# EAGLE schematic analog_heteroThermistor_3xChannel_R3 (EAGLE 7.6.0)
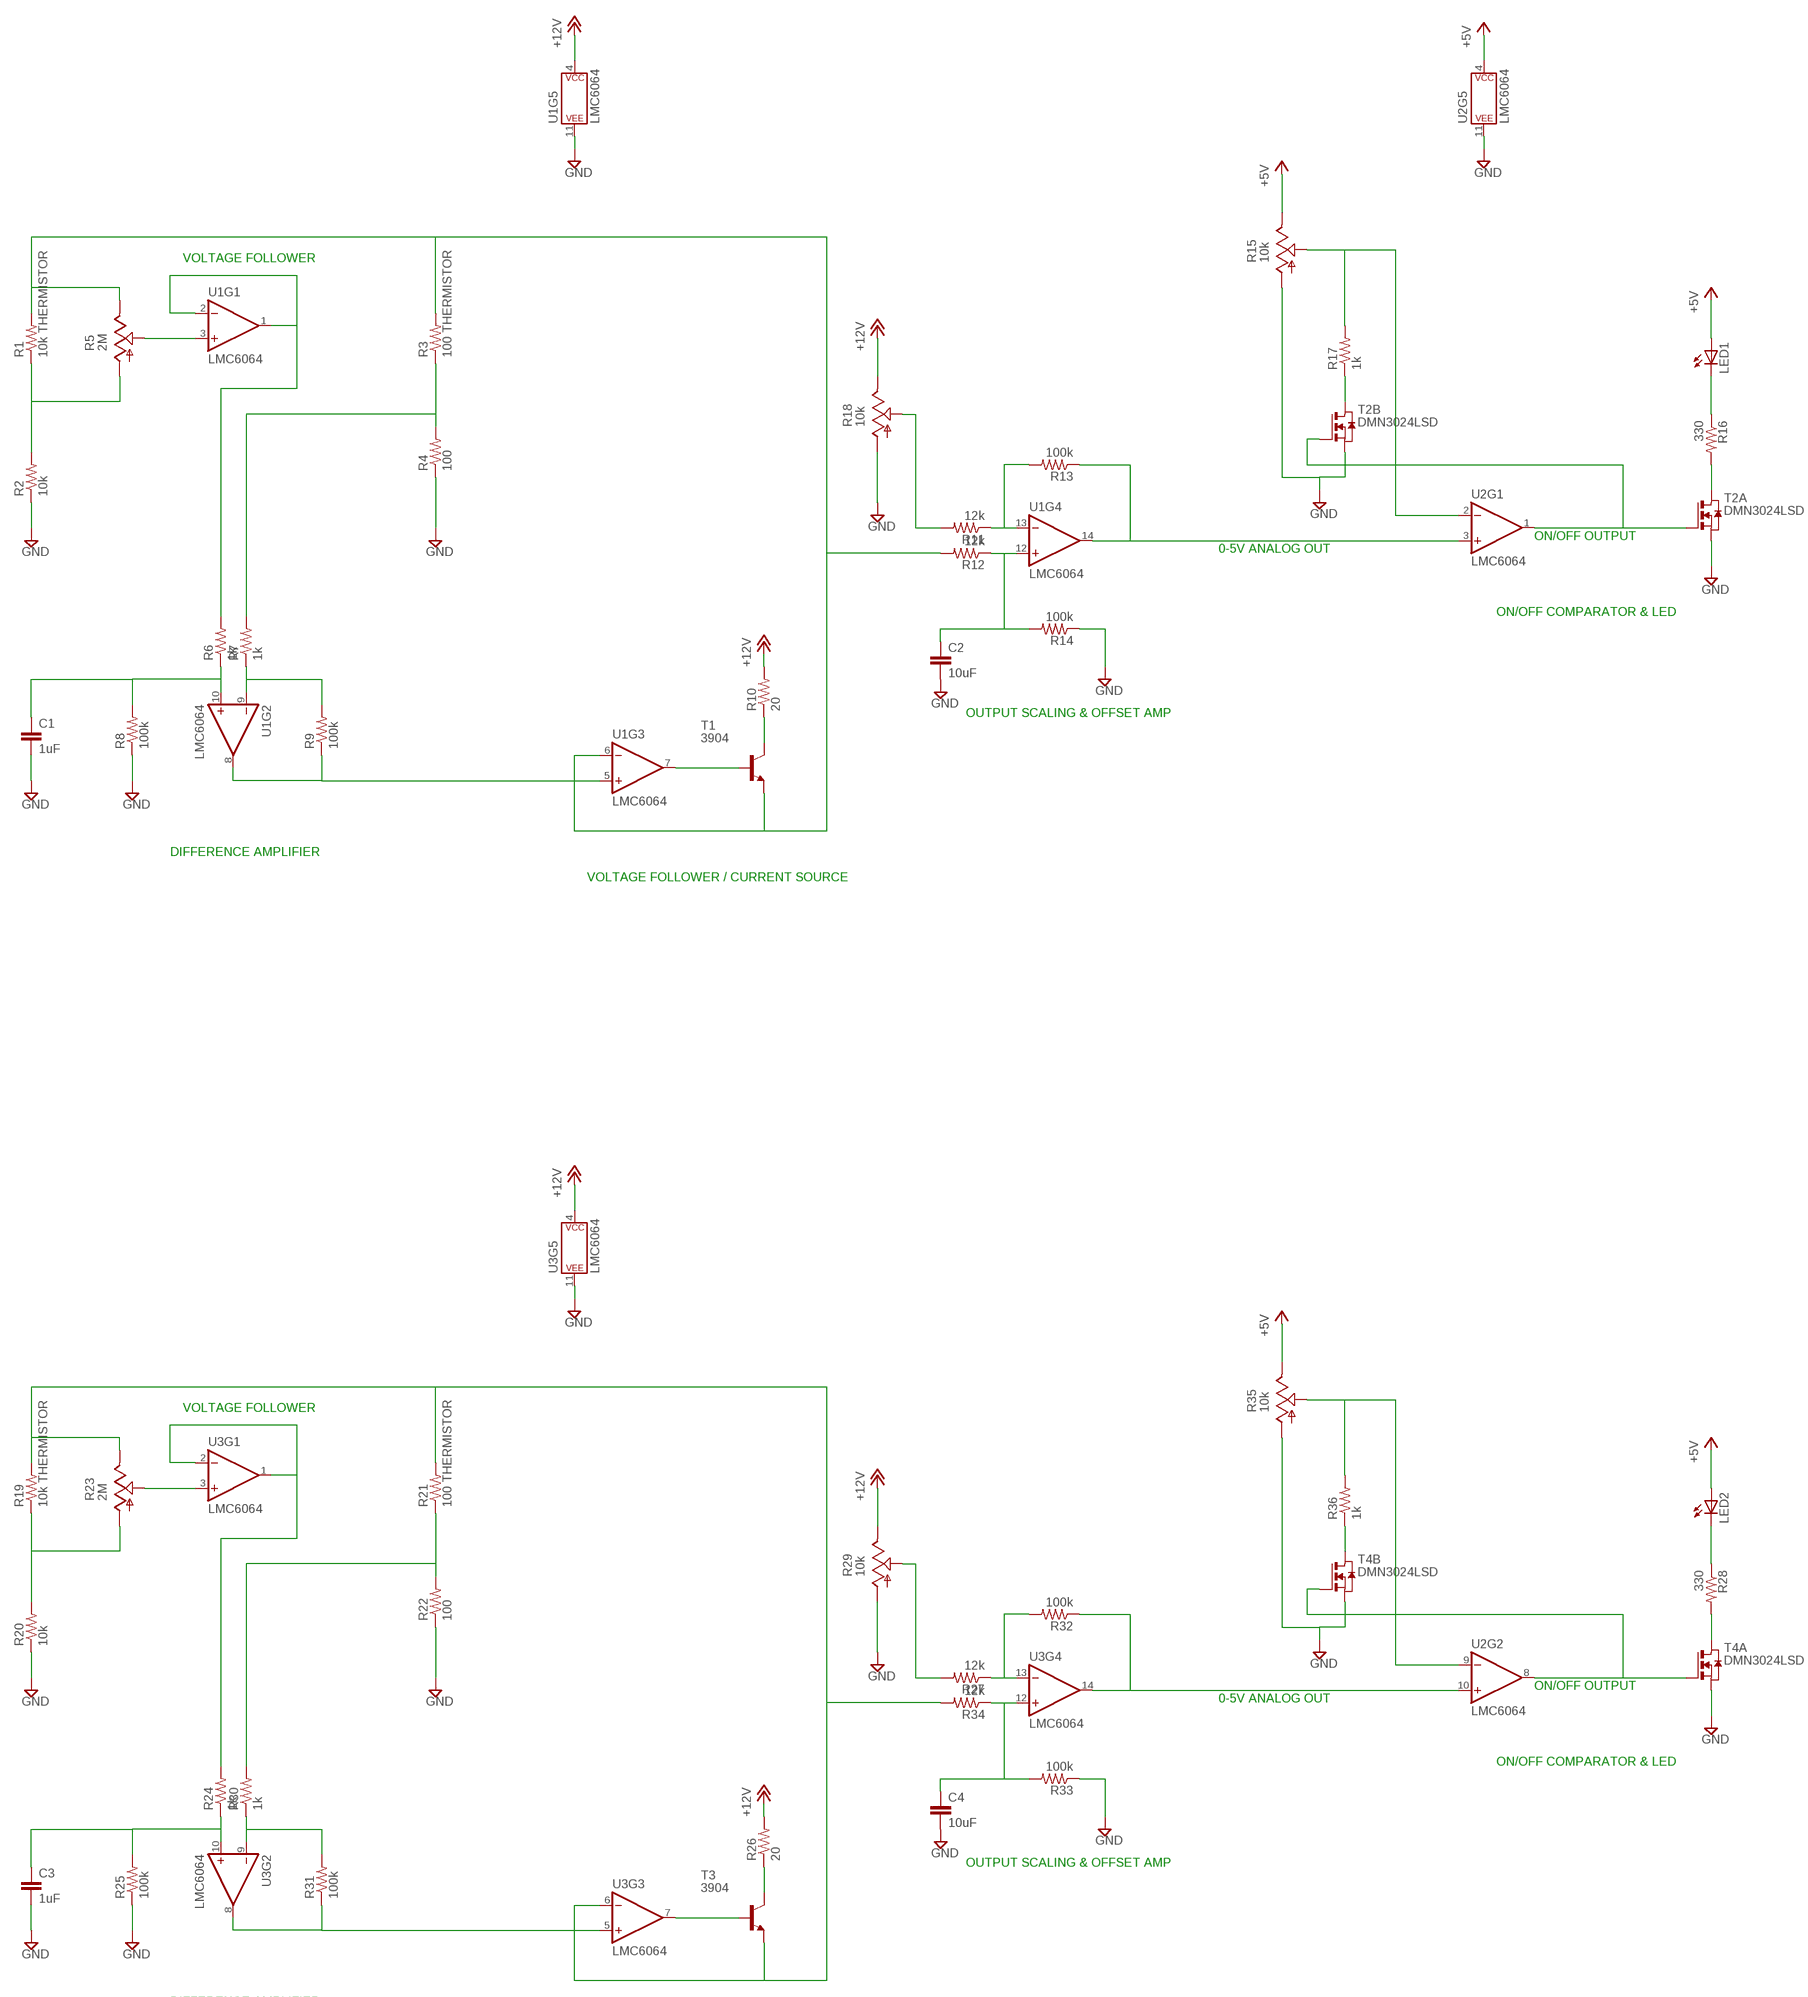
[diagram p0: schematic, sheet 1, part 1 of 2]
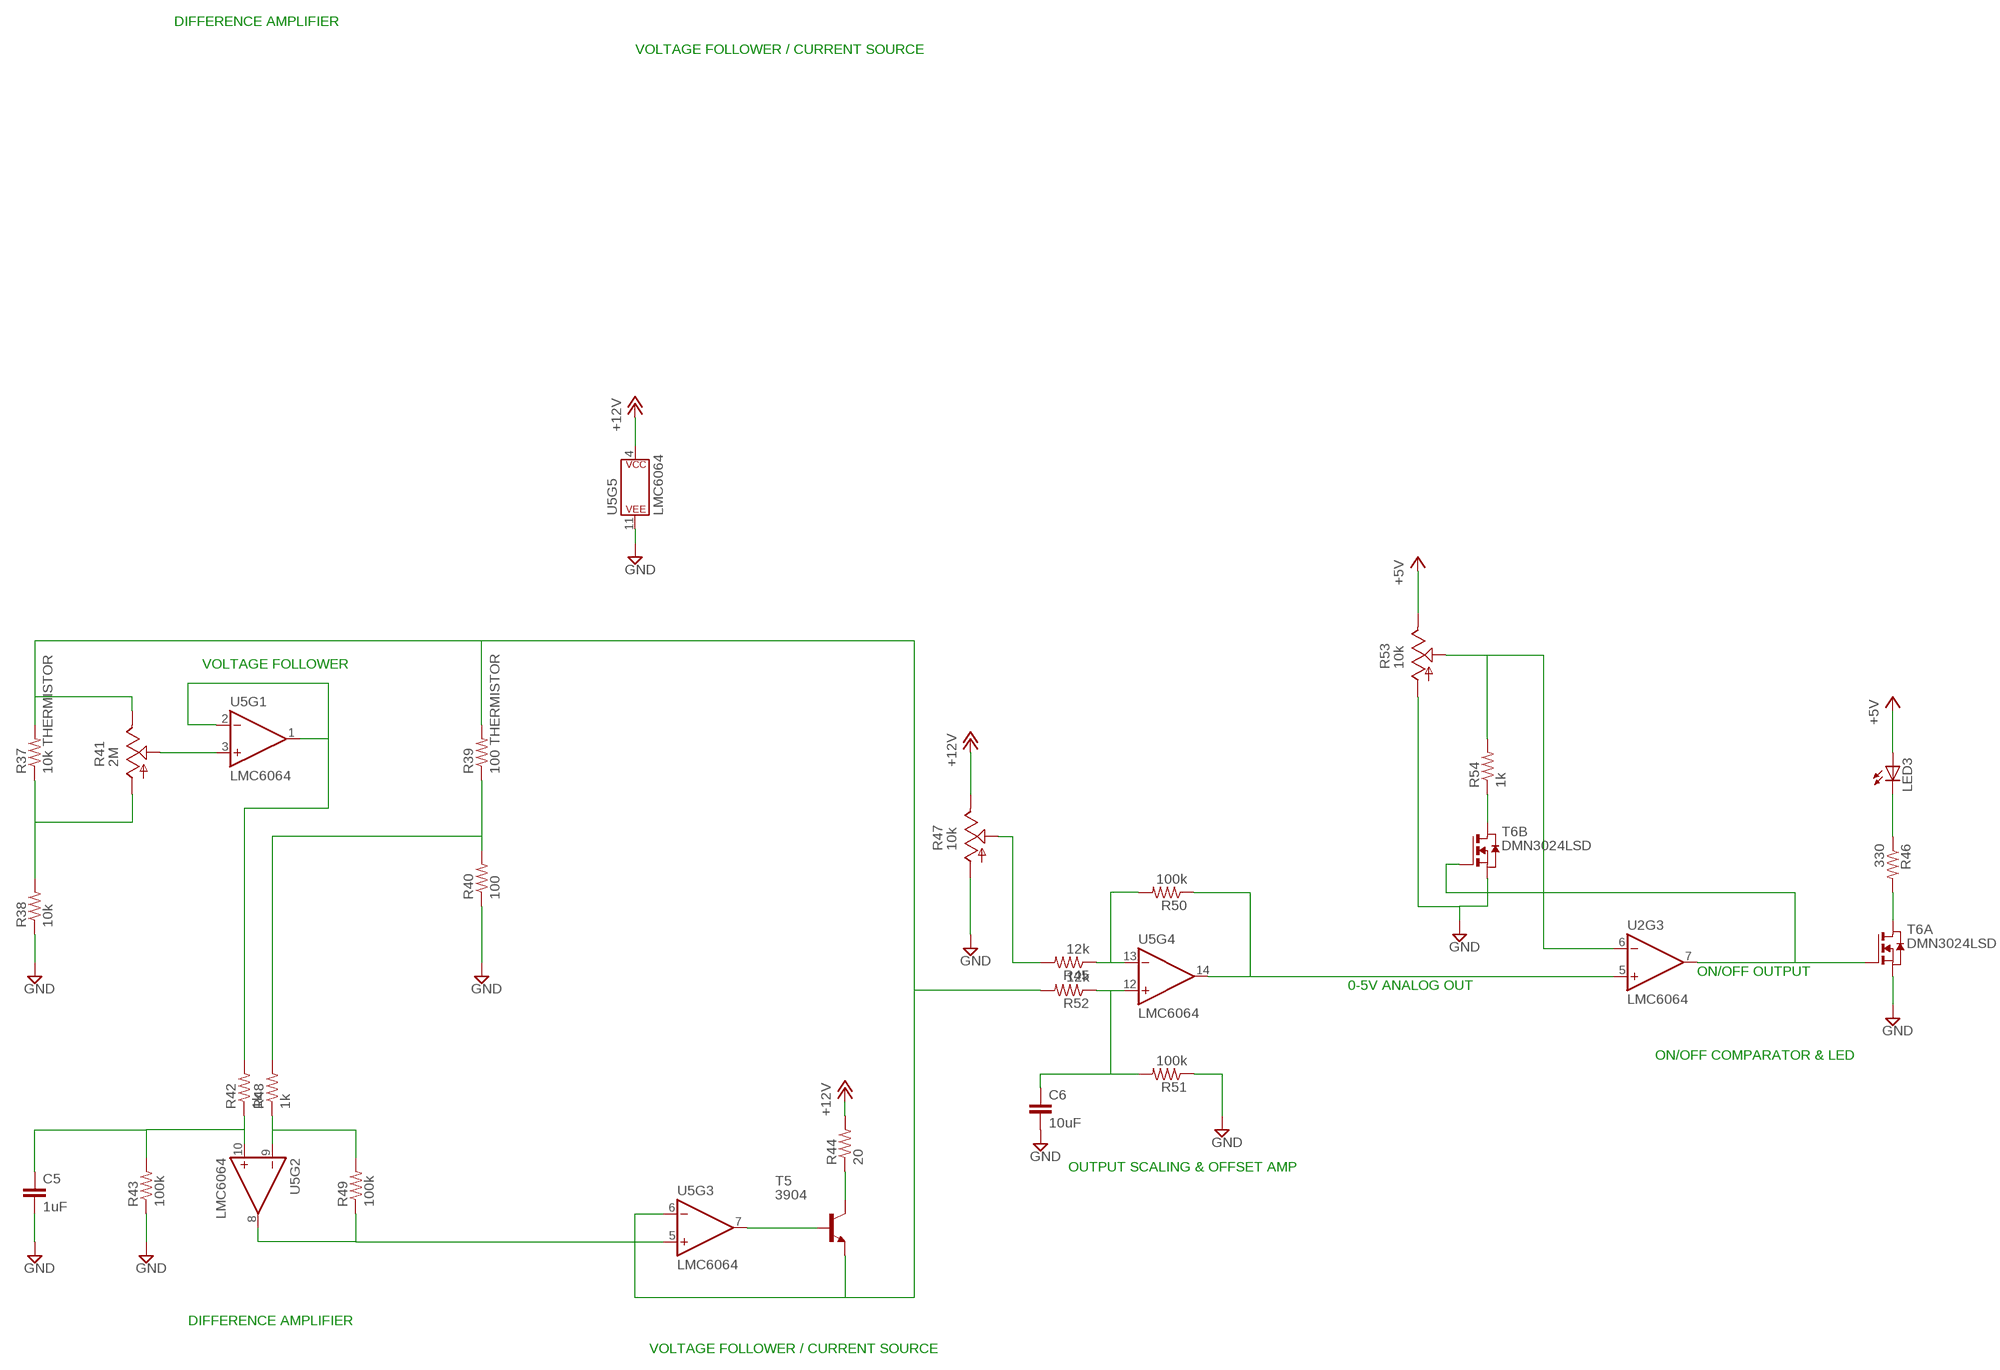
[diagram p1: schematic, sheet 1, part 2 of 2]

## Parts
C1  1uF  C-EUC0603  [C0603]
C2  10uF  C-EUC0603  [C0603]
C3  1uF  C-EUC0603  [C0603]
C4  10uF  C-EUC0603  [C0603]
C5  1uF  C-EUC0603  [C0603]
C6  10uF  C-EUC0603  [C0603]
LED1  LEDCHIPLED_1206  [CHIPLED_1206]
LED2  LEDCHIPLED_1206  [CHIPLED_1206]
LED3  LEDCHIPLED_1206  [CHIPLED_1206]
R1  10k THERMISTOR  R-US_R0603  [R0603]
R2  10k  R-US_R0603  [R0603]
R3  100 THERMISTOR  R-US_R0603  [R0603]
R4  100  R-US_R0603  [R0603]
R5  2M  TRIM_US-SM-42/43W  [SM-42/43W]
R6  1k  R-US_R0603  [R0603]
R7  1k  R-US_R0603  [R0603]
R8  100k  R-US_R0603  [R0603]
R9  100k  R-US_R0603  [R0603]
R10  20  R-US_R0603  [R0603]
R11  12k  R-US_R0603  [R0603]
R12  12k  R-US_R0603  [R0603]
R13  100k  R-US_R0603  [R0603]
R14  100k  R-US_R0603  [R0603]
R15  10k  TRIM_US-SM-42/43W  [SM-42/43W]
R16  330  R-US_R0603  [R0603]
R17  1k  R-US_R0603  [R0603]
R18  10k  TRIM_US-SM-42/43W  [SM-42/43W]
R19  10k THERMISTOR  R-US_R0603  [R0603]
R20  10k  R-US_R0603  [R0603]
R21  100 THERMISTOR  R-US_R0603  [R0603]
R22  100  R-US_R0603  [R0603]
R23  2M  TRIM_US-SM-42/43W  [SM-42/43W]
R24  1k  R-US_R0603  [R0603]
R25  100k  R-US_R0603  [R0603]
R26  20  R-US_R0603  [R0603]
R27  12k  R-US_R0603  [R0603]
R28  330  R-US_R0603  [R0603]
R29  10k  TRIM_US-SM-42/43W  [SM-42/43W]
R30  1k  R-US_R0603  [R0603]
R31  100k  R-US_R0603  [R0603]
R32  100k  R-US_R0603  [R0603]
R33  100k  R-US_R0603  [R0603]
R34  12k  R-US_R0603  [R0603]
R35  10k  TRIM_US-SM-42/43W  [SM-42/43W]
R36  1k  R-US_R0603  [R0603]
R37  10k THERMISTOR  R-US_R0603  [R0603]
R38  10k  R-US_R0603  [R0603]
R39  100 THERMISTOR  R-US_R0603  [R0603]
R40  100  R-US_R0603  [R0603]
R41  2M  TRIM_US-SM-42/43W  [SM-42/43W]
R42  1k  R-US_R0603  [R0603]
R43  100k  R-US_R0603  [R0603]
R44  20  R-US_R0603  [R0603]
R45  12k  R-US_R0603  [R0603]
R46  330  R-US_R0603  [R0603]
R47  10k  TRIM_US-SM-42/43W  [SM-42/43W]
R48  1k  R-US_R0603  [R0603]
R49  100k  R-US_R0603  [R0603]
R50  100k  R-US_R0603  [R0603]
R51  100k  R-US_R0603  [R0603]
R52  12k  R-US_R0603  [R0603]
R53  10k  TRIM_US-SM-42/43W  [SM-42/43W]
R54  1k  R-US_R0603  [R0603]
T1  3904  MMBT3904LT1-NPN-SOT23-BEC  [SOT23-BEC]
T2  DMN3024LSD  [SO8]
T3  3904  MMBT3904LT1-NPN-SOT23-BEC  [SOT23-BEC]
T4  DMN3024LSD  [SO8]
T5  3904  MMBT3904LT1-NPN-SOT23-BEC  [SOT23-BEC]
T6  DMN3024LSD  [SO8]
U1  LMC6064  [SO14]
U2  LMC6064  [SO14]
U3  LMC6064  [SO14]
U5  LMC6064  [SO14]

## Nets
+5V: LED1.A LED2.A LED3.A R15.3(E) R35.3(E) R53.3(E) U2.4(P$V+)
+12V: R10.2 R18.3(E) R26.2 R29.3(E) R44.2 R47.3(E) U1.4(P$V+) U3.4(P$V+) U5.4(P$V+)
GND: C1.2 C2.2 C3.2 C4.2 C5.2 C6.2 R2.1 R4.1 R8.1 R14.1 R15.1(A) R18.1(A) R20.1 R22.1 R25.1 R29.1(A) R33.1 R35.1(A) R38.1 R40.1 R43.1 R47.1(A) R51.1 R53.1(A) T2.1(A:S) T2.3(B:S) T4.1(A:S) T4.3(B:S) T6.1(A:S) T6.3(B:S) U1.11(P$V-) U2.11(P$V-) U3.11(P$V-) U5.11(P$V-)
N$1: R5.2(S) U1.3(+IN)
N$2: T2.2(A:G) T2.4(B:G) U2.1(OUT)
N$3: R1.1 R2.2 R5.1(A)
N$4: T1.B U1.7(OUT)
N$5: R6.2 U1.1(OUT) U1.2(-IN)
N$6: C1.1 R6.1 R8.2 U1.10(+IN)
N$7: R7.1 R9.2 U1.9(-IN)
N$8: R9.1 U1.5(+IN) U1.8(OUT)
N$9: R3.1 R4.2 R7.2
N$10: R1.2 R3.2 R5.3(E) R12.2 T1.E U1.6(-IN)
N$11: R10.1 T1.C
N$12: C2.1 R12.1 R14.2 U1.12(+IN)
N$13: R11.1 R13.2 U1.13(-IN)
N$14: R15.2(S) R17.2 U2.2(-IN)
N$15: R13.1 U1.14(OUT) U2.3(+IN)
N$16: R16.2 T2.7(A:D) T2.8(A:D)
N$17: LED1.C R16.1
N$18: R23.2(S) U3.3(+IN)
N$19: R19.1 R20.2 R23.1(A)
N$20: R17.1 T2.5(B:D) T2.6(B:D)
N$21: R24.2 U3.1(OUT) U3.2(-IN)
N$22: R11.2 R18.2(S)
N$23: C3.1 R24.1 R25.2 U3.10(+IN)
N$24: R30.1 R31.2 U3.9(-IN)
N$25: R31.1 U3.5(+IN) U3.8(OUT)
N$26: R21.1 R22.2 R30.2
N$27: R19.2 R21.2 R23.3(E) R34.2 T3.E U3.6(-IN)
N$28: C4.1 R33.2 R34.1 U3.12(+IN)
N$29: R27.1 R32.2 U3.13(-IN)
N$30: R35.2(S) R36.2 U2.9(-IN)
N$31: R32.1 U2.10(+IN) U3.14(OUT)
N$32: T4.2(A:G) T4.4(B:G) U2.8(OUT)
N$33: LED2.C R28.1
N$34: T3.B U3.7(OUT)
N$35: R26.1 T3.C
N$36: R28.2 T4.7(A:D) T4.8(A:D)
N$37: R36.1 T4.5(B:D) T4.6(B:D)
N$38: R27.2 R29.2(S)
N$39: R41.2(S) U5.3(+IN)
N$40: R37.1 R38.2 R41.1(A)
N$41: R42.2 U5.1(OUT) U5.2(-IN)
N$42: C5.1 R42.1 R43.2 U5.10(+IN)
N$43: R48.1 R49.2 U5.9(-IN)
N$44: R49.1 U5.5(+IN) U5.8(OUT)
N$45: R39.1 R40.2 R48.2
N$46: R37.2 R39.2 R41.3(E) R52.2 T5.E U5.6(-IN)
N$47: C6.1 R51.2 R52.1 U5.12(+IN)
N$48: R45.1 R50.2 U5.13(-IN)
N$49: R53.2(S) R54.2 U2.6(-IN)
N$50: R50.1 U2.5(+IN) U5.14(OUT)
N$51: T6.2(A:G) T6.4(B:G) U2.7(OUT)
N$52: LED3.C R46.1
N$53: T5.B U5.7(OUT)
N$54: R44.1 T5.C
N$55: R46.2 T6.7(A:D) T6.8(A:D)
N$56: R54.1 T6.5(B:D) T6.6(B:D)
N$57: R45.2 R47.2(S)
Unconnected: U2.12(+IN) U2.13(-IN) U2.14(OUT)

## Notes on the sheet
- VOLTAGE FOLLOWER
- ON/OFF OUTPUT
- 0-5V ANALOG OUT
- ON/OFF COMPARATOR & LED
- OUTPUT SCALING & OFFSET AMP
- DIFFERENCE AMPLIFIER
- VOLTAGE FOLLOWER / CURRENT SOURCE
- VOLTAGE FOLLOWER
- ON/OFF OUTPUT
- 0-5V ANALOG OUT
- ON/OFF COMPARATOR & LED
- OUTPUT SCALING & OFFSET AMP
- DIFFERENCE AMPLIFIER
- VOLTAGE FOLLOWER / CURRENT SOURCE
- VOLTAGE FOLLOWER
- ON/OFF OUTPUT
- 0-5V ANALOG OUT
- ON/OFF COMPARATOR & LED
- OUTPUT SCALING & OFFSET AMP
- DIFFERENCE AMPLIFIER
- VOLTAGE FOLLOWER / CURRENT SOURCE

## Library data of the parts
C1 C3 C5 = resistor:C-EU: CAPACITOR, European symbol; DISTR: Digikey; DISTRPN: 490-1536-1-ND; MF: Murata Electronics North America; MPN: GRM188R61C105KA93D
C2 C4 C6 = resistor:C-EU: CAPACITOR, European symbol; DISTR: Digikey; DISTRPN: 490-7198-1-ND; MF: Murata Electronics North America; MPN: GRM188C81C106MA73D
LED1-LED3 = led:LED: LED OSRAM: - CHIPLED LG R971, LG N971, LY N971, LG Q971, LY Q971, LO R971, LY R971 LH N974, LH R974 LS Q976, LO Q976, LY Q976 LO Q996 - Hyper CHIPLED LW Q18S LB Q993, LB Q99A, LB R99A - SideLED LS A670, LO A670, LY A670, LG A670, LP A670 LB A673, LV A673, LT A673, LW A673 LH A674 LY A675 LS A676, LA A676, LO A676, LY A676, LW A676 LS A679, LY A679, LG A679 - Hyper Micro SIDELED® LS Y876, LA Y876, LO Y876, LY Y876 LT Y87S - SmartLED LW L88C, LW L88S LB L89C, LB L89S, LG L890 LS L89K, LO L89K, LY L89K LS L896, LA L896, LO L896, LY L896 - TOPLED LS T670, LO T670, LY T670, LG T670, LP T670 LSG T670, LSP T670, LSY T670, LOP T670, LYG T670 LG T671, LOG T671, LSG T671 LB T673, LV T673, LT T673, LW T673 LH T674 LS T676, LA T676, LO T676, LY T676, LB T676, LH T676, LSB T676, LW T676 LB T67C, LV T67C, LT T67C, LS T67K, LO T67K, LY T67K, LW E67C LS E67B, LA E67B, LO E67B, LY E67B, LB E67C, LV E67C, LT E67C LW T67C LS T679, LY T679, LG T679 LS T770, LO T770, LY T770, LG T770, LP T770 LB T773, LV T773, LT T773, LW T773 LH T774 LS E675, LA E675, LY E675, LS T675 LS T776, LA T776, LO T776, LY T776, LB T776 LHGB T686 LT T68C, LB T68C - Hyper Mini TOPLED® LB M676 - Mini TOPLED Santana® LG M470 LS M47K, LO M47K, LY M47K Source: http://www.osram.convergy.de LUXEON: - LUMILED® LXK2-PW12-R00, LXK2-PW12-S00, LXK2-PW14-U00, LXK2-PW14-V00 LXK2-PM12-R00, LXK2-PM12-S00, LXK2-PM14-U00 LXK2-PE12-Q00, LXK2-PE12-R00, LXK2-PE12-S00, LXK2-PE14-T00, LXK2-PE14-U00 LXK2-PB12-K00, LXK2-PB12-L00, LXK2-PB12-M00, LXK2-PB14-N00, LXK2-PB14-P00, LXK2-PB14-Q00 LXK2-PR12-L00, LXK2-PR12-M00, LXK2-PR14-Q00, LXK2-PR14-R00 LXK2-PD12-Q00, LXK2-PD12-R00, LXK2-PD12-S00 LXK2-PH12-R00, LXK2-PH12-S00 LXK2-PL12-P00, LXK2-PL12-Q00, LXK2-PL12-R00 Source: www.luxeon.com KINGBRIGHT: KA-3528ASYC Source: www.kingbright.com; DISTR: Digikey; DISTRPN: 160-1169-1-ND; MF: Lite-On Inc.; MPN: LTST-C150GKT
R1 R19 R37 = resistor:R-US_: RESISTOR, American symbol; DISTR: Digikey; DISTRPN: 490-2436-1-ND; MF: Murata Electronics North America; MPN: NCP18XH103J03RB
R2 R20 R38 = resistor:R-US_: RESISTOR, American symbol; DISTR: Digikey; DISTRPN: P10KBYCT-ND; MF: Panasonic Electronic Components; MPN: ERJ-PA3F1002V
R3 R21 R39 = resistor:R-US_: RESISTOR, American symbol; DISTR: Digikey; DISTRPN: 490-2434-1-ND; MF: Murata Electronics North America; MPN: NCP18XF101J03RB
R4 R22 R40 = resistor:R-US_: RESISTOR, American symbol; DISTR: Digikey; DISTRPN: P100BYCT-ND; MF: Panasonic Electronic Components; MPN: ERJ-PA3F1000V
R5 R23 R41 = pot:TRIM_US-: POTENTIOMETER; DISTR: Digikey; DISTRPN: SM-42TW205CT-ND; MF: Copal Electronics Inc.; MPN: SM-42TW205
R6 R7 R17 R24 R30 R36 R42 R48 R54 = resistor:R-US_: RESISTOR, American symbol; DISTR: Digikey; DISTRPN: P1.0KBYCT-ND; MF: Panasonic Electronic Components; MPN: ERJ-PA3F1001V
R8 R9 R13 R14 R25 R31-R33 R43 R49-R51 = resistor:R-US_: RESISTOR, American symbol; DISTR: Digikey; DISTRPN: P100KBYCT-ND; MF: Panasonic Electronic Components; MPN: ERJ-PA3F1003V
R10 R26 R44 = resistor:R-US_: RESISTOR, American symbol; DISTR: Digikey; DISTRPN: P20.00BYCT-ND; MF: Panasonic Electronic Components; MPN: ERJ-PA3F20R0V
R11 R12 R27 R34 R45 R52 = resistor:R-US_: RESISTOR, American symbol; DISTR: Digikey; DISTRPN: P12KBYCT-ND; MF: Panasonic Electronic Components; MPN: ERJ-PA3F1202V
R15 R18 R29 R35 R47 R53 = pot:TRIM_US-: POTENTIOMETER; DISTR: Digikey; DISTRPN: SM-42TW103CT-ND; MF: Copal Electronics Inc.; MPN: SM-42TW103
R16 R28 R46 = resistor:R-US_: RESISTOR, American symbol; DISTR: Digikey; DISTRPN: P330BYCT-ND; MF: Panasonic Electronic Components; MPN: ERJ-PA3F3300V
T1 T3 T5 = transistor-neu-to92:*-NPN-: NPN Transistror; DISTR: Digikey; DISTRPN: MMBT3904FSCT-ND; MF: Fairchild/ON Semiconductor; MPN: MMBT3904
T2 T4 T6 = zetex:DMN3024LSD: 30V DUAL N-CHANNEL ENHANCEMENT MODE MOSFET Source: Data sheet <http://www.diodes.com/datasheets/DMN3024LSD.pdf>; DISTR: Digikey; DISTRPN: DMN3024LSD-13DICT-ND; MF: Diodes Incorporated; MPN: DMN3024LSD-13; OC_FARNELL: unknown; OC_NEWARK: unknown
U1-U3 U5 = SparkFun-IC-Amplifiers:LMC6064: IC LMV324 Quad Op Amp Jellybean quad op-amp Datasheet <http://cdn.sparkfun.com/datasheets/Sensors/Sound/LMV324.pdf> SparkFun Products SparkFun Sensor Kit <https://www.sparkfun.com/products/13754> (DEV-13754) SparkFun Inventor's Kit for Arduino 101 <https://www.sparkfun.com/products/13844> (KIT-13844) SparkFun Sound Detector <https://www.sparkfun.com/products/12642> (SEN-12642); DISTR: Digikey; DISTRPN: 296-35438-1-ND; MF: Texas Instruments; MPN: LMC6064AIMX/NOPB; PROD_ID: LMC6064